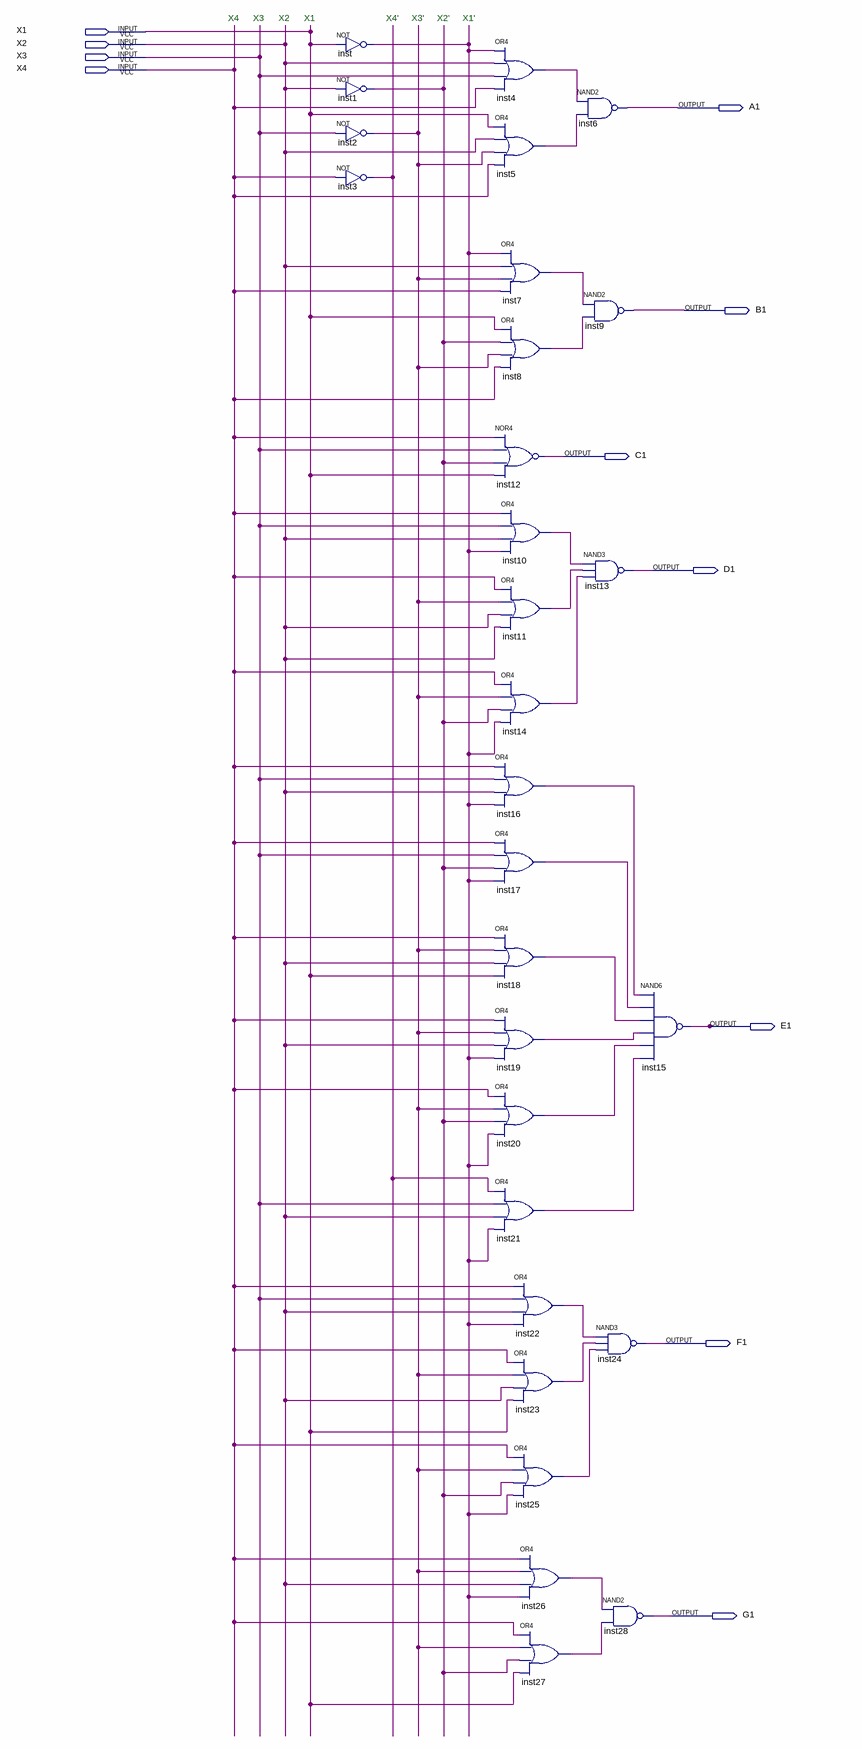
[diagram p0: schematic sheet]
// Quartus schematic Indicator1.bdf as structural Verilog: 29 symbols, 11 pins
module Indicator1 (
  input  X1,
  input  X2,
  input  X3,
  input  X4,
  output A1,
  output B1,
  output C1,
  output D1,
  output E1,
  output F1,
  output G1
);

  wire inst1_out, inst2_out, inst3_out, inst4_out, inst5_out, inst7_out, inst8_out, inst10_out, inst11_out,
       inst14_out, inst16_out, inst17_out, inst18_out, inst19_out, inst20_out, inst21_out, inst22_out,
       inst23_out, inst25_out, inst26_out, inst27_out, inst_out;

  not inst (inst_out, X1);
  not inst1 (inst1_out, X2);
  not inst2 (inst2_out, X3);
  not inst3 (inst3_out, X4);
  or inst4 (inst4_out, inst_out, X2, X3, X4);
  or inst5 (inst5_out, X1, X2, inst2_out, X4);
  or inst7 (inst7_out, inst_out, X2, inst2_out, X4);
  or inst8 (inst8_out, X1, inst1_out, inst2_out, X4);
  nor inst12 (C1, X4, X3, inst1_out, X1);
  or inst10 (inst10_out, X4, X3, X2, inst_out);
  or inst11 (inst11_out, X4, inst2_out, X2, X2);
  or inst14 (inst14_out, X4, inst2_out, inst1_out, inst_out);
  or inst16 (inst16_out, X4, X3, X2, inst_out);
  or inst17 (inst17_out, X4, X3, inst1_out, inst_out);
  or inst18 (inst18_out, X4, inst2_out, X2, X1);
  or inst19 (inst19_out, X4, inst2_out, X2, inst_out);
  or inst20 (inst20_out, X4, inst2_out, inst1_out, inst_out);
  or inst21 (inst21_out, inst3_out, X3, X2, inst_out);
  or inst22 (inst22_out, X4, X3, X2, inst_out);
  or inst23 (inst23_out, X4, inst2_out, X2, X1);
  or inst25 (inst25_out, X4, inst2_out, inst1_out, inst_out);
  or inst26 (inst26_out, X4, inst2_out, X2, inst_out);
  or inst27 (inst27_out, X4, inst2_out, inst1_out, X1);
  nand inst6 (A1, inst4_out, inst5_out);
  nand inst9 (B1, inst7_out, inst8_out);
  nand inst13 (D1, inst10_out, inst11_out, inst14_out);
  nand inst15 (E1, inst16_out, inst17_out, inst18_out, inst19_out, inst20_out, inst21_out);
  nand inst24 (F1, inst22_out, inst23_out, inst25_out);
  nand inst28 (G1, inst26_out, inst27_out);

  // Notes on the sheet:
  //   X4
  //   X3
  //   X2
  //   X1
  //   X4'
  //   X3'
  //   X2'
  //   X1'
endmodule
